# EasyEDA Pro project 送药小车_JLC_EDA_专业版.epro

# Schematic Schematic1
Create Date: 2024-10-30; Page Name: P1; Project Name: 送药小车; Schematic Name: Schematic1; Update Date: 2024-10-30; Company: 嘉立创EDA; Page Size: A4; Version: V1.0
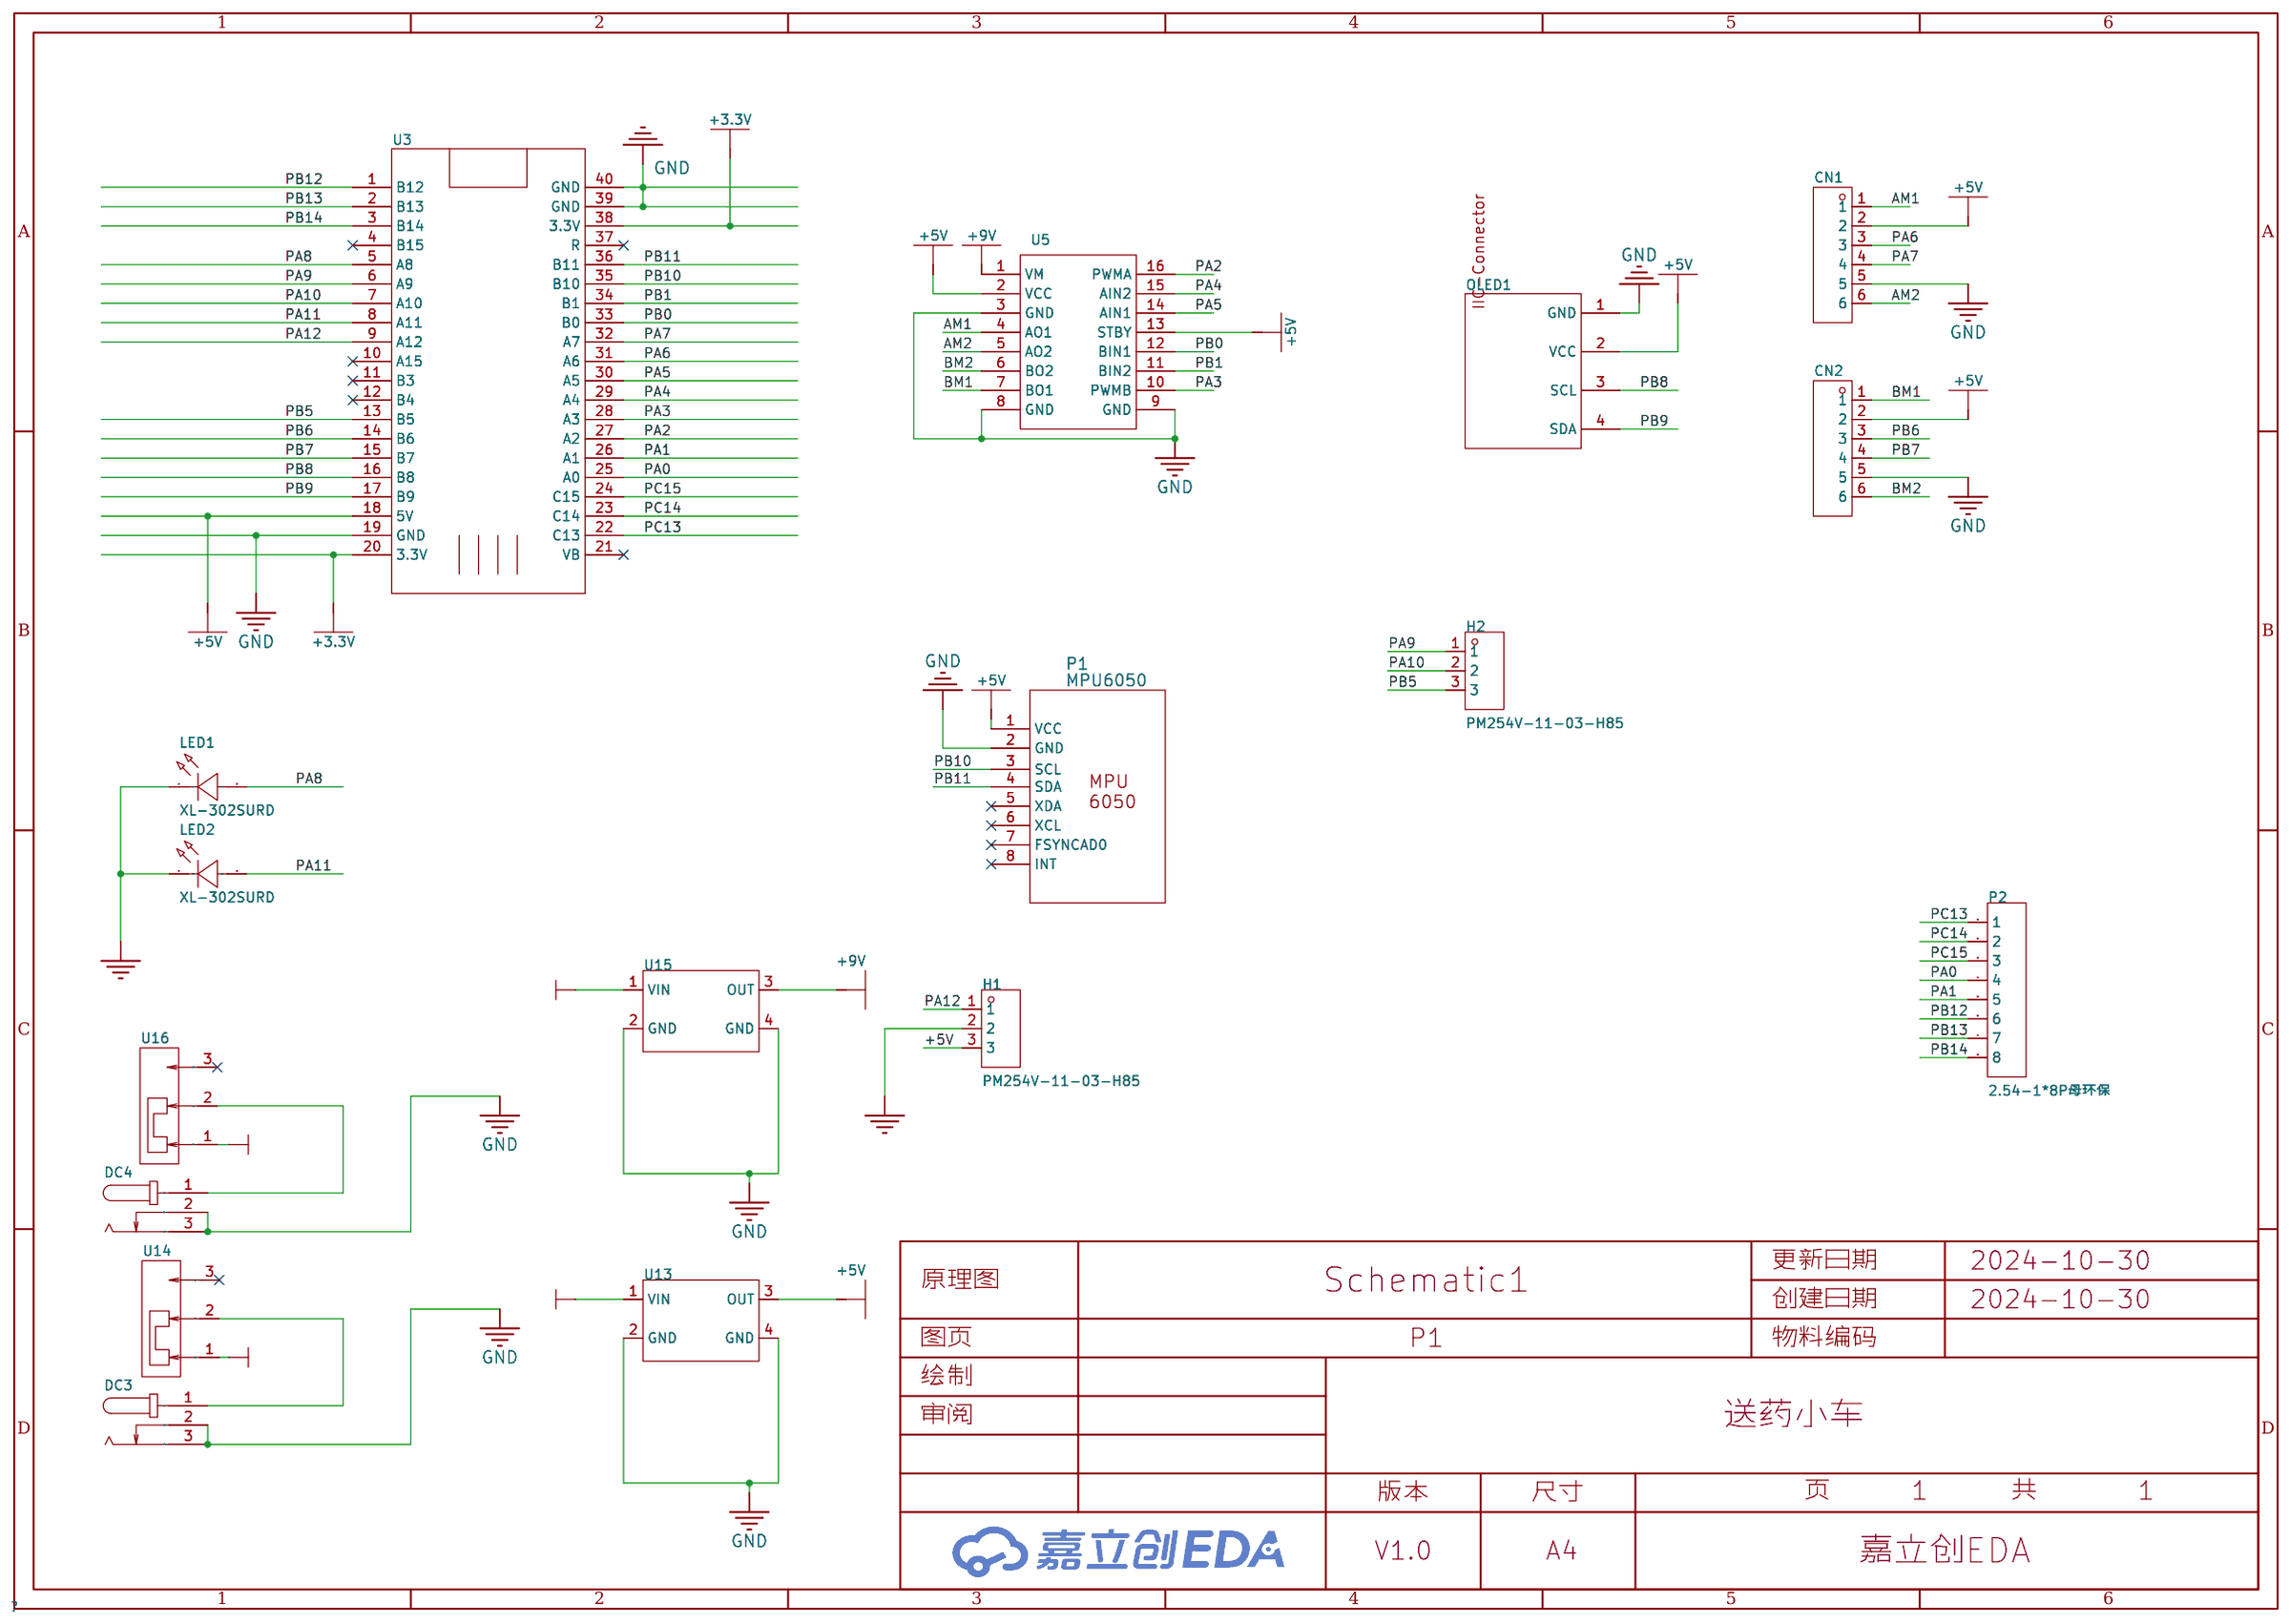
[diagram p0: schematic sheet]

## Parts
CN1  PH2.0-6P  [ph2.0-6p 直针端子座]
CN2  PH2.0-6P  [ph2.0-6p 直针端子座]
DC3  -  [dc-in-th_kh-dc-005-2.5]
DC4  -  [dc-in-th_kh-dc-005-2.5]
H1  PM254V-11-03-H85  [HDR-TH_3P-P2.54-V-F]
H2  PM254V-11-03-H85  [HDR-TH_3P-P2.54-V-F]
LED1  XL-302SURD  [LED-TH_BD3.8-P2.54-RD]
LED2  XL-302SURD  [LED-TH_BD3.8-P2.54-RD]
OLED1  -  [0.96oled_4p]
P1  MPU6050  [mpu6050]
P2  2.54-1*8P母环保  [HDR-TH_8P-P2.54-V-F-1]
U3  -  [stm32f103c8t6核心板]
U5  -  [tb6612fng module - 8pin x 2]
U13  -  [MP1584模块]
U14  SS-12D10-G5  [SW-TH_SS-12D10-G050]
U15  -  [MP1584模块]
U16  SS-12D10-G5  [SW-TH_SS-12D10-G050]

## Library data of the parts
CN1 CN2 = PH2.0-6P: Pin Type: IN; Supplier: LCSC; Supplier Part: C722763; Manufacturer: CAX(创都); Manufacturer Part: PH2.0-4P; JLCPCB Part Class: Extended Part
DC3 DC4 = KH-DC-005-2.5: 连接器类型:DC电源插座;安装方式:弯插;触点内径:-;触点外径:6.4mm;额定电流:1A;额定电压:30V;工作温度范围:-25~+70;; LCSC Part Name: DC电源插座 外径:6.4mm; Supplier Part: C2847170; Manufacturer: kinghelm(金航标); Supplier Footprint: 插件; JLCPCB Part Class: Extended Part; Datasheet: https://atta.szlcsc.com/upload/public/pdf/source/20210716/C2847170_7F0110A0BEDEE81C68B76DF87AC8DA16.pdf; Supplier: LCSC; Connector Type: DC电源插座; Mounting Style: 弯插; Outside Contact Diameter: 6.4mm; Current Rating (Max): 1A; Voltage Rating (Max): 30V; Operating Temperature Range: -25~+70
H1 H2 = PM254V-11-03-H85: 插孔结构:1x3P;间距:2.54mm;行距:-;安装类型:直插;排数:单排;总孔位数:3P;塑高:-;触头材质:黄铜;触头镀层:-;; LCSC Part Name: 间距:2.54mm 1x3P 直插; Supplier Part: C541850; Manufacturer: XFCN(兴飞); Supplier Footprint: 插件,P=2.54mm; JLCPCB Part Class: 扩展库; Datasheet: https://atta.szlcsc.com/upload/public/pdf/source/20200518/C541849_85853D71FC67C51915A806977A588FDA.pdf; Supplier: LCSC; Holes Structure: 1x3P; Pitch: 2.54mm; Mounting Type: 直插; Number of Rows: 单排; Number of Holes: 3P; Contact Material: 黄铜
LED1 LED2 = XL-302SURD: 灯头类型:3mm圆形灯头;发光颜色:红色;功率:80mW;正向电流:30mA;主波长:615nm~620nm;透镜颜色:红色透镜;色温:-;发光角度:50°;载带方式:-;工作温度:-25℃~+85℃;; Supplier Part: C2895470; Manufacturer: XINGLIGHT(成兴光); Supplier Footprint: 插件,D=3mm; JLCPCB Part Class: 扩展库; Datasheet: https://atta.szlcsc.com/upload/public/pdf/source/20240112/E1E2B82945FD635E4907401DDE6D4922.pdf; Supplier: LCSC; Lamp Holder Type: 3mm圆形灯头; Emitted Color: 红色; Power Dissipation: 80mW; Forward Current: 30mA; Dominant Wavelength: 615nm~620nm; Peak Wavelength: 625nm; Lens Color: 红色透镜; Viewing Angle: 50°; Operating Temperature: -25℃~+85℃
OLED1 = 0.96OLED_4P: LCSC Part Name: 0.96OLED_4P_MODULE_JX; Supplier Part: C9900004566; Manufacturer Part: 0.96OLED_4P_MODULE_JX; Supplier Footprint: THrough hole; JLCPCB Part Class: Extended Part; Supplier: LCSC
P1 = MPU6050
P2 = 2.54-1*8P母环保: 插孔结构:1x8P;间距:2.54mm;行距:-;安装类型:直插;排数:单排;总孔位数:8P;塑高:-;触头材质:-;触头镀层:-;; LCSC Part Name: 间距:2.54mm 1x8P 直插; Supplier Part: C27438; Manufacturer: BOOMELE(博穆精密); Supplier Footprint: 插件,P=2.54mm; JLCPCB Part Class: 扩展库; Datasheet: https://atta.szlcsc.com/upload/public/pdf/source/20231221/1CA800C6799ED97958773716FAA1BFFE.pdf; Supplier: LCSC; Holes Structure: 1x8P; Pitch: 2.54mm; Mounting Type: 直插; Number of Rows: 单排; Number of Holes: 8P
U3 = stm32f103c8t6最小系统板
U5 = TB6612FNG模块: Pin Type: In
U13 U15 = MP1584模块: Pin Type: IN
U14 U16 = SS-12D10-G5: 电路结构:单刀双掷;安装方式:直插;开关颜色:黑色;滑钮形状:矩形柱状;引脚样式:PC引脚;开关长度:12.7mm;开关宽度:6.7mm;开关高度:11.3mm;; LCSC Part Name: 插件大电流拨动开关; Supplier Part: C2998777; Manufacturer: DEALON(德艺隆); Supplier Footprint: 插件; JLCPCB Part Class: Extended Part; Datasheet: https://atta.szlcsc.com/upload/public/pdf/source/20220428/E10CB334ACBAF32CF4AF8D87DA871CD3.pdf; Supplier: LCSC; Circuit: 单刀双掷; Mounting Style: 直插; Actuator Color: 黑色; Actuator Style: 矩形柱状; Pin Style: PC引脚; Switch Length: 12.7mm; Switch Width: 6.7mm; Switch Height: 11.3mm

## Nets
+3.3V: U3.20(3.3V) U3.38(3.3V)
+5V: CN1.2 CN2.2 H1.3 OLED1.2(VCC) P1.1(VCC) U3.18(5V) U5.2(VCC) U5.13(STBY) U13.3(OUT)
+9V: U5.1(VM) U15.3(OUT)
+12.5V: U15.1(VIN) U16.1
+12V: U13.1(VIN) U14.1
GND: CN1.5 CN2.5 DC3.2 DC3.3 DC4.2 DC4.3 H1.2 LED1.1(K) LED2.1(K) OLED1.1(GND) P1.2(GND) U3.19(GND) U3.39(GND) U3.40(GND) U5.3(GND) U5.8(GND) U5.9(GND) U13.2(GND) U13.4(GND) U15.2(GND) U15.4(GND)
AM1: CN1.1 U5.4(AO1)
AM2: CN1.6 U5.5(AO2)
BM1: CN2.1 U5.7(BO1)
BM2: CN2.6 U5.6(BO2)
PA0: P2.4 U3.25(A0)
PA1: P2.5 U3.26(A1)
PA2: U3.27(A2) U5.16(PWMA)
PA3: U3.28(A3) U5.10(PWMB)
PA4: U3.29(A4) U5.15(AIN2)
PA5: U3.30(A5) U5.14(AIN1)
PA6: CN1.3 U3.31(A6)
PA7: CN1.4 U3.32(A7)
PA8: LED1.2(A) U3.5(A8)
PA9: H2.1 U3.6(A9)
PA10: H2.2 U3.7(A10)
PA11: LED2.2(A) U3.8(A11)
PA12: H1.1 U3.9(A12)
PB0: U3.33(B0) U5.12(BIN1)
PB1: U3.34(B1) U5.11(BIN2)
PB5: H2.3 U3.13(B5)
PB6: CN2.3 U3.14(B6)
PB7: CN2.4 U3.15(B7)
PB8: OLED1.3(SCL) U3.16(B8)
PB9: OLED1.4(SDA) U3.17(B9)
PB10: P1.3(SCL) U3.35(B10)
PB11: P1.4(SDA) U3.36(B11)
PB12: P2.6 U3.1(B12)
PB13: P2.7 U3.2(B13)
PB14: P2.8 U3.3(B14)
PC13: P2.1 U3.22(C13)
PC14: P2.2 U3.23(C14)
PC15: P2.3 U3.24(C15)
$1N1604: DC3.1 U14.2
$1N2413: DC4.1 U16.2

Not connected (* = marked no-connect by the designer): P1 5(XDA)* 6(XCL)* 7(FSYNCAD0)* 8(INT)*; U3 4(B15)* 10(A15)* 11(B3)* 12(B4)* 21(VB)* 37(R)*; U14 3*; U16 3*

# Board PCB1
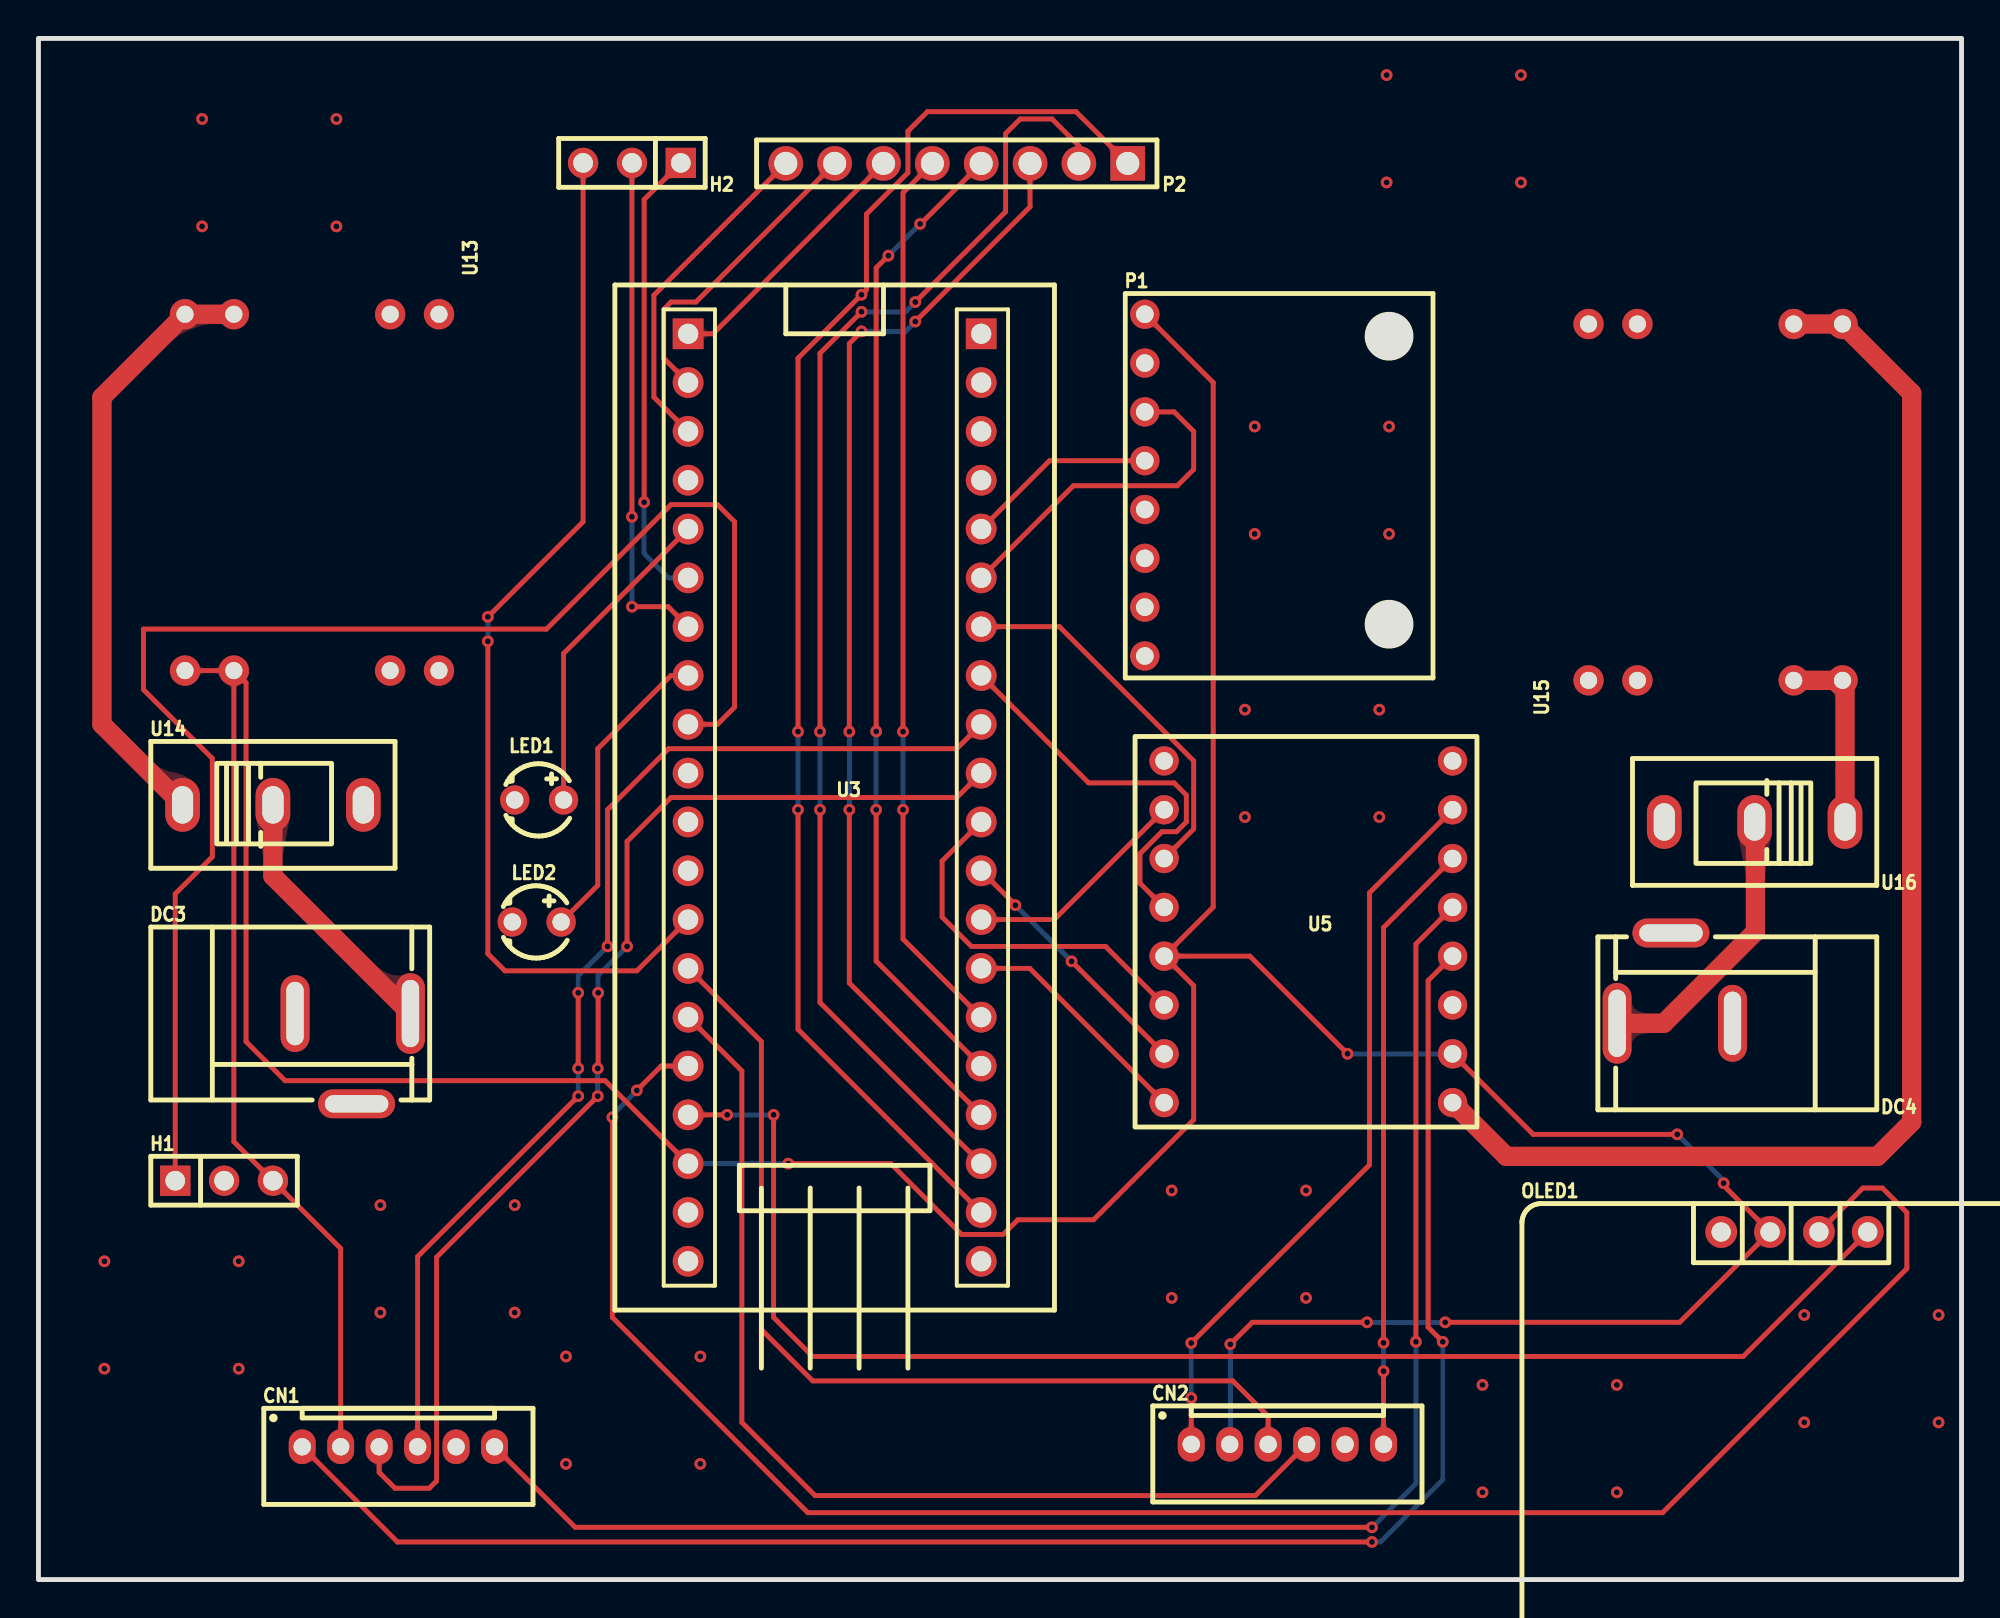
[diagram p1: board, top side]
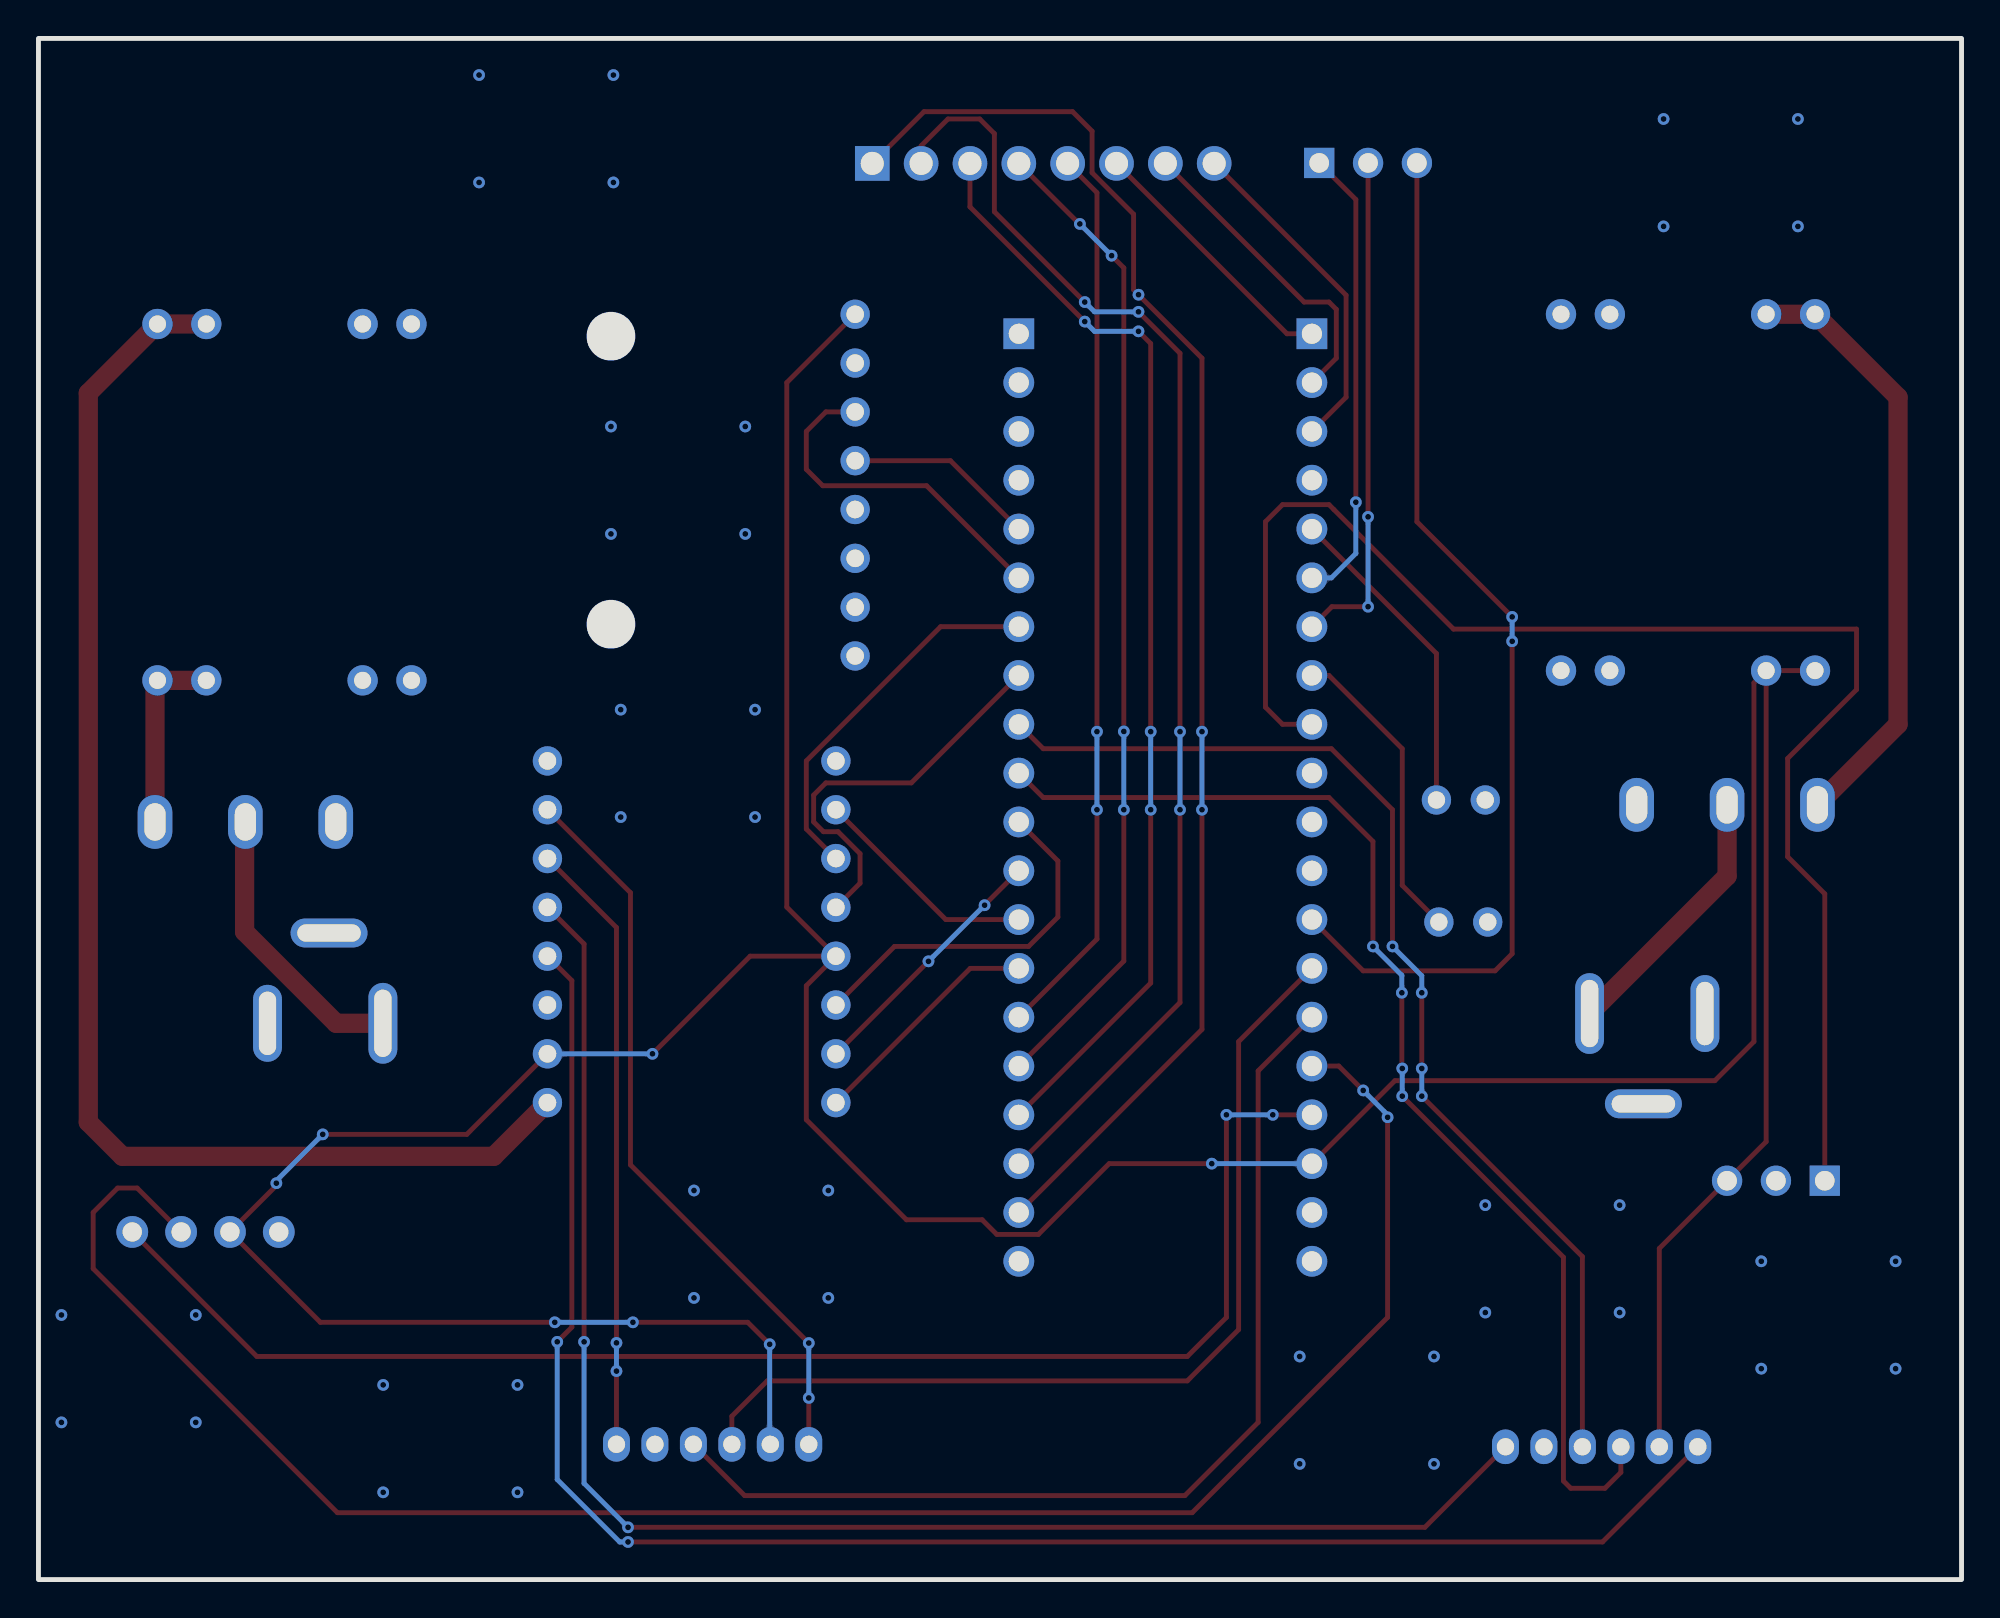
[diagram p2: board, bottom side, seen from below]

Outline 100 x 80.19 mm; copper layers: Top Layer, Bottom Layer. Coordinates in mm from the lower left corner of the outline.
Outline path: rectangle 0,80.19 100,0
Stack: Top Layer 0.035mm / Dielectric1 1.51mm FR4 er 4.5 / Bottom Layer 0.035mm

## Design rules (mm)
template: JLCPCB Capability(Two Layers Board)
spacing copperThickness1oz (default): track to track 0.102, other pairs 0.152 to 0.3
spacing copperThickness2oz: track to track 0.203, other pairs 0.152 to 0.3
track width copperThickness1oz (default): min 0.127, default 0.254, max 2.54
track width copperThickness2oz: min 0.203, default 0.254, max 2.54
differential pair differentialPair (default): width min 0.127, default 0.254, max 2.54; gap min 0.152, default 0.152
via viaSize (default): diameter min 0.5, default 0.61, max 10; hole min 0.3, default 0.305, max 6.3

## Placement (name value [footprint] x y rotation side)
CN1  PH2.0-6P  [ph2.0-6p 直针端子座]  13.72 6.91 0 top
CN2  PH2.0-6P  [ph2.0-6p 直针端子座]  59.94 7.04 0 top
DC3  -  [dc-in-th_kh-dc-005-2.5]  16.34 27.1 0 top
DC4  -  [dc-in-th_kh-dc-005-2.5]  85.09 31.29 180 top
H1  PM254V-11-03-H85  [HDR-TH_3P-P2.54-V-F]  9.65 20.75 0 top
H2  PM254V-11-03-H85  [HDR-TH_3P-P2.54-V-F]  30.86 73.71 180 top
LED1  XL-302SURD  [LED-TH_BD3.8-P2.54-RD]  26.03 40.56 0 top
LED2  XL-302SURD  [LED-TH_BD3.8-P2.54-RD]  25.91 34.21 0 top
OLED1  -  [0.96oled_4p]  91.31 18.08 0 top
P1  MPU6050  [mpu6050]  56.51 46.91 0 top
P2  2.54-1*8P母环保  [HDR-TH_8P-P2.54-V-F-1]  47.75 73.69 180 top
U3  -  [stm32f103c8t6核心板]  41.4 40.69 0 top
U5  -  [tb6612fng module - 8pin x 2]  65.91 33.71 180 top
U13  -  [MP1584模块]  14.22 56.57 270 top
U14  SS-12D10-G5  [SW-TH_SS-12D10-G050]  12.19 40.31 0 top
U15  -  [MP1584模块]  87.21 56.06 90 top
U16  SS-12D10-G5  [SW-TH_SS-12D10-G050]  89.24 39.42 180 top

## Footprints (pads in the part's own frame, mm; a bottom-side part is the same pattern mirrored in y, then rotated)
0.96oled_4p
  round 1.651 hole 1.001: 1(-3.81,0) 2(-1.27,0.003) 3(1.27,0.003) 4(3.81,0.003)
dc-in-th_kh-dc-005-2.5
  oval 1.501x4.201 hole 0.899x3.5: 1(2.999,2.349)
  oval 1.501x4 hole 0.899x3.3: 2(-2.999,2.349)
  oval 4x1.501 hole 3.3x0.899: 3(0.201,-2.349)
HDR-TH_3P-P2.54-V-F
  rect 1.575x1.575 hole 1.02: 1(-2.54,0)
  round 1.575 hole 1.02: 2(0,0) 3(2.54,0)
HDR-TH_8P-P2.54-V-F-1
  rect 1.8x1.8 hole 1.2: 1(-8.89,0)
  round 1.8 hole 1.2: 2(-6.35,0) 3(-3.81,0) 4(-1.27,0) 5(1.27,0) 6(3.81,0) 7(6.35,0) 8(8.89,0)
LED-TH_BD3.8-P2.54-RD
  round 1.524 hole 0.9: 1(-1.27,0) 2(1.27,0)
MP1584模块
  round 1.575 hole 0.889: 1(-9.271,-4.064) 1(-9.271,-6.604) 2(-9.271,6.604) 2(-9.271,4.064) 3(9.271,-4.064) 3(9.271,-6.604) 4(9.271,6.604) 4(9.271,4.064)
mpu6050
  round 1.524 hole 0.914: 1(1.016,18.923) 2(1.016,16.383) 3(1.016,13.843) 4(1.016,11.303) 5(1.016,8.763) 6(1.016,6.223) 7(1.016,3.683) 8(1.016,1.143)
ph2.0-6p 直针端子座
  oval 1.4x1.8 hole 0.9: 1(0,0) 2(2,0) 3(4,0) 4(6,0) 5(8,0) 6(10,0)
stm32f103c8t6核心板
  rect 1.6x1.6 hole 1.049: 1(-7.62,24.13) 40(7.62,24.13)
  round 1.6 hole 1.049: 2(-7.62,21.59) 3(-7.62,19.05) 4(-7.62,16.51) 5(-7.62,13.97) 6(-7.62,11.43) 7(-7.62,8.89) 8(-7.62,6.35) 9(-7.62,3.81) 10(-7.62,1.27) 11(-7.62,-1.27) 12(-7.62,-3.81) 13(-7.62,-6.35) 14(-7.62,-8.89) 15(-7.62,-11.43) 16(-7.62,-13.97) 17(-7.62,-16.51) 18(-7.62,-19.05) 19(-7.62,-21.59) 20(-7.62,-24.13) 21(7.62,-24.13) 22(7.62,-21.59) 23(7.62,-19.05) 24(7.62,-16.51) 25(7.62,-13.97) 26(7.62,-11.43) 27(7.62,-8.89) 28(7.62,-6.35) 29(7.62,-3.81) 30(7.62,-1.27) 31(7.62,1.27) 32(7.62,3.81) 33(7.62,6.35) 34(7.62,8.89) 35(7.62,11.43) 36(7.62,13.97) 37(7.62,16.51) 38(7.62,19.05) 39(7.62,21.59)
SW-TH_SS-12D10-G050
  oval 1.8x2.8 hole 1.1x1.95: 1(-4.7,0) 2(0,0) 3(4.7,0)
tb6612fng module - 8pin x 2
  round 1.524 hole 0.914: 1(-7.62,8.89) 2(-7.62,6.35) 3(-7.62,3.81) 4(-7.62,1.27) 5(-7.62,-1.27) 6(-7.62,-3.81) 7(-7.62,-6.35) 8(-7.62,-8.89) 9(7.38,-8.89) 10(7.38,-6.35) 11(7.38,-3.81) 12(7.38,-1.27) 13(7.38,1.27) 14(7.38,3.81) 15(7.38,6.35) 16(7.38,8.89)

## Nets
As in the schematic, except:
+3.3V: U3.38

Pads without a net: P1 5 6 7 8; U3 4 10 11 12 20 21 37; U14 3; U16 3

## Via types
v1: diameter 0.61, hole 0.305, Top Layer to Bottom Layer, 91 vias

## Routing (per net, layer and track width the routed paths; a pad name or vN(x,y) marks a point on that pad's centre or on a via; arc(x,y) is an arc through that point)
+5V: length 239.1
  Top Layer w0.254: 58.53,32.44 61.09,34.99 61.09,62.28 57.53,65.84 ; 58.53,32.44 62.99,32.44 v1(68.07,27.36) ; 58.53,32.44 60.07,30.9 60.07,23.93 54.86,18.72 50.93,18.72 50.16,17.96 48.01,17.96 44.32,21.64 v1(38.99,21.64) ; U13.3 10.16,22.78 H1.3 15.72,17.23 CN1.2 ; U13.3 U13.3 ; U13.3 10.8,46.66 10.8,27.99 12.83,25.96 29.46,25.96 U3.18 ; v1(69.09,13.39) 63.12,13.39 v1(61.98,12.24) ; 73.53,27.36 77.72,23.16 v1(85.22,23.16) ; v1(73.15,13.39) 85.34,13.39 90.04,18.09 87.63,20.5 v1(87.63,20.62)
  Bottom Layer w0.254: v1(68.07,27.36) 73.53,27.36 ; v1(87.63,20.62) 87.63,20.75 v1(85.22,23.16) ; CN2.2 61.98,7.07 v1(61.98,12.24) ; v1(69.09,13.39) v1(73.15,13.39) ; U3.18 v1(38.99,21.64)
+9V: length 71.3
  Top Layer w1: 73.53,24.82 76.33,22.02 95.63,22.02 97.41,23.8 97.41,61.73 U15.3 U15.3
+12.5V: length 10
  Top Layer w1: U16.1 93.94,46.66 U15.1 U15.1
+12V: length 31.6
  Top Layer w1: U14.1 3.3,44.5 3.3,61.52 U13.1 U13.1
GND:
  vias: v1(3.43,16.56) v1(3.43,10.97) v1(8.51,76) v1(8.51,70.41) v1(10.41,16.56) v1(10.41,10.97) v1(15.49,76) v1(15.49,70.41) v1(17.78,19.48) v1(17.78,13.89) v1(24.77,19.48) v1(24.77,13.89) v1(27.43,11.61) v1(27.43,6.02) v1(34.42,11.61) v1(34.42,6.02) v1(58.93,20.24) v1(58.93,14.66) v1(62.74,45.26) v1(62.74,39.67) v1(63.25,60) v1(63.25,54.41) v1(65.91,20.24) v1(65.91,14.66) v1(69.72,45.26) v1(69.72,39.67) v1(70.1,78.28) v1(70.1,72.69) v1(70.23,60) v1(70.23,54.41) v1(75.09,10.13) v1(75.09,4.54) v1(77.09,78.28) v1(77.09,72.69) v1(82.07,10.13) v1(82.07,4.54) v1(91.82,13.77) v1(91.82,8.18) v1(98.81,13.77) v1(98.81,8.18)
AM1: length 90.8
  Top Layer w0.254: CN1.1 18.67,1.96 v1(69.34,1.96) ; v1(73.03,12.37) 72.26,13.13 72.26,31.17 73.53,32.44
  Bottom Layer w0.254: v1(69.34,1.96) 69.77,1.96 73.03,5.21 v1(73.03,12.37)
AM2: length 81.4
  Top Layer w0.254: CN1.6 27.91,2.72 v1(69.34,2.72) ; v1(71.63,12.37) 71.63,33.07 73.53,34.98
  Bottom Layer w0.254: v1(69.34,2.72) 71.63,5 v1(71.63,12.37)
BM1: length 38.6
  Top Layer w0.254: CN2.1 v1(59.94,9.45) ; 73.53,40.06 69.22,35.74 69.22,21.58 v1(59.94,12.31)
  Bottom Layer w0.254: v1(59.94,9.45) v1(59.94,12.31)
BM2: length 32
  Top Layer w0.254: 73.53,37.52 69.94,33.93 v1(69.94,12.32) ; CN2.6 v1(69.94,10.85)
  Bottom Layer w0.254: v1(69.94,10.85) v1(69.94,12.32)
PA0: length 51.5
  Top Layer w0.254: v1(43.56,44.13) 43.56,68.25 v1(44.2,68.88) ; v1(45.85,70.54) 45.87,70.54 P2.4 ; v1(43.56,40.06) 43.56,32.18 U3.25
  Bottom Layer w0.254: v1(45.85,70.54) v1(44.2,68.88) ; v1(43.56,40.06) v1(43.56,44.13)
PA1: length 46.6
  Top Layer w0.254: v1(44.96,40.06) 44.96,33.33 U3.26 ; P2.5 44.96,72.16 v1(44.96,44.12)
  Bottom Layer w0.254: v1(44.96,40.06) 44.96,43.99
PA2: length 12.4
  Top Layer w0.254: 58.53,24.82 51.55,31.8 U3.27
PA3: length 11.9
  Top Layer w0.254: 58.53,40.06 52.82,34.34 U3.28
PA4: length 13.5
  Top Layer w0.254: 53.72,32.18 v1(53.72,32.17) 58.53,27.36 ; U3.29 50.8,35.1 v1(50.8,35.09)
  Bottom Layer w0.254: v1(53.72,32.17) v1(50.8,35.09) 50.8,35.1
PA5: length 19.2
  Top Layer w0.254: 58.53,29.9 55.49,32.94 48.51,32.94 46.99,34.47 46.99,37.39 U3.30
PA6: length 62.1
  Top Layer w0.254: U3.31 47.75,40.69 32.89,40.69 30.61,38.41 v1(30.61,32.94) ; CN1.3 17.72,5.58 18.54,4.75 20.32,4.75 20.7,5.13 20.7,16.77 v1(29.08,25.15) ; v1(29.1,30.53) 29.1,26.61 v1(29.08,26.59)
  Bottom Layer w0.254: v1(29.1,30.53) 29.1,31.44 v1(30.61,32.94) ; v1(29.08,26.59) v1(29.08,25.15)
PA7: length 58.5
  Top Layer w0.254: U3.32 47.75,43.23 32.77,43.23 29.59,40.06 v1(29.59,32.94) ; CN1.4 19.72,16.8 v1(28.07,25.15) ; v1(28.07,30.53) v1(28.07,26.59)
  Bottom Layer w0.254: v1(29.59,32.94) 28.07,31.42 v1(28.07,30.53) ; v1(28.07,26.59) v1(28.07,25.15)
PA9: length 23.9
  Top Layer w0.254: v1(31.5,56.06) 31.5,71.81 H2.1
  Bottom Layer w0.254: U3.6 32.77,52.12 31.5,53.39 v1(31.5,56.06)
PA10: length 26.4
  Top Layer w0.254: H2.2 v1(30.86,55.3) ; v1(30.86,50.62) 32.74,50.62 U3.7
  Bottom Layer w0.254: v1(30.86,55.3) v1(30.86,50.62)
PA12: length 77.2
  Top Layer w0.254: H1.1 7.11,35.68 9.04,37.61 9.04,42.72 5.46,46.3 5.46,49.45 26.42,49.45 32.89,55.93 35.31,55.93 36.19,55.04 36.19,45.39 35.31,44.5 U3.9
PB0: length 21.1
  Top Layer w0.254: 58.53,34.98 57.28,36.23 57.28,37.77 58.42,38.91 59.18,38.91 59.69,39.42 59.69,40.82 59.06,41.45 54.61,41.45 U3.33
PB1: length 19.7
  Top Layer w0.254: U3.34 53.09,49.58 60.07,42.6 60.07,39.05 58.53,37.52
PB5: length 55.1
  Top Layer w0.254: H2.3 28.32,55.04 v1(23.37,50.09) ; U3.13 31.12,31.67 24.26,31.67 23.37,32.56 v1(23.37,48.82)
  Bottom Layer w0.254: v1(23.37,48.82) v1(23.37,50.09)
PB6: length 50.1
  Top Layer w0.254: CN2.3 63.94,8.5 62.1,10.34 40.26,10.34 37.59,13 37.59,27.99 U3.14
PB7: length 54.3
  Top Layer w0.254: CN2.4 63.28,4.37 40.39,4.37 36.58,8.18 36.58,26.47 U3.15
PB8: length 101.3
  Top Layer w0.254: U3.16 32.38,26.72 v1(31.12,25.45) ; OLED1.3 94.87,20.37 95.88,20.37 97.16,19.1 97.16,16.18 84.46,3.48 40,3.48 29.84,13.64 v1(29.84,24.05)
  Bottom Layer w0.254: v1(31.12,25.45) 29.84,24.18 v1(29.84,24.05)
PB9: length 75.4
  Top Layer w0.254: OLED1.4 88.64,11.61 40.26,11.61 38.23,13.64 v1(38.23,24.18) ; v1(35.81,24.18) U3.17
  Bottom Layer w0.254: v1(35.81,24.18) v1(38.23,24.18)
PB12: length 13.8
  Top Layer w0.254: U3.1 35.08,64.82 P2.6
PB13: length 16.4
  Top Layer w0.254: P2.7 34.19,66.47 32.89,66.47 32.51,66.09 32.51,63.55 U3.2
PB14: length 17.5
  Top Layer w0.254: U3.3 32,61.52 32,66.83 P2.8
PC13: length 75.5
  Top Layer w0.254: v1(39.5,44.12) 39.5,63.55 v1(42.8,66.85) 43.05,67.11 43.05,71.04 45.21,73.2 45.21,75.36 46.23,76.38 53.95,76.38 P2.1 ; v1(39.5,40.06) 39.5,28.63 U3.22
  Bottom Layer w0.254: v1(39.5,40.06) v1(39.5,44.12)
PC14: length 68
  Top Layer w0.254: v1(42.8,65.96) 40.64,63.8 v1(40.64,44.12) ; v1(40.64,40.06) 40.64,30.02 U3.23 ; v1(45.59,66.47) 50.29,71.17 50.29,75.23 51.05,76 52.71,76 54.1,74.6 P2.2
  Bottom Layer w0.254: v1(40.64,44.12) v1(40.64,40.06) ; v1(45.59,66.47) 45.09,65.96 v1(42.8,65.96)
PC15: length 57.6
  Top Layer w0.254: P2.3 51.56,71.42 v1(45.59,65.46) ; v1(42.16,44.12) 42.16,64.31 v1(42.8,64.95) ; v1(42.16,40.06) 42.16,31.04 U3.24
  Bottom Layer w0.254: v1(42.8,64.95) 45.09,64.95 v1(45.59,65.46) ; v1(42.16,40.06) v1(42.16,44.12)
$1N1604: length 13.8
  Top Layer w1: DC3.1 12.19,36.6 U14.2
$1N2413: length 14.9
  Top Layer w1: U16.2 89.28,39.38 89.28,33.71 84.52,28.94 DC4.1
PA8: length 16.8
  Top Layer w0.254: U3.5 27.31,48.18 LED1.2
PA11: length 16.1
  Top Layer w0.254: LED2.2 29.08,36.12 29.08,43.23 32.89,47.04 U3.8
PB10: length 18.3
  Top Layer w0.254: U3.35 53.81,56.91 59.22,56.91 60.07,57.77 60.07,59.74 59.06,60.76 57.53,60.76
PB11: length 10
  Top Layer w0.254: U3.36 52.58,58.22 57.53,58.22

## Copper pours and planes (outline as drawn; the poured copper is in the pictures)
GND on Top Layer: -15.11,89.08 114.05,89.08 114.05,-17.35 -15.11,-17.35
GND on Bottom Layer: -20.95,93.52 124.33,93.52 124.33,-27 -20.95,-27

Small or netless copper shapes (teardrops, artwork), in the pictures only: 137 on Top Layer, 54 on Bottom Layer
